# EAGLE design CZT_Board_v1_4 (EAGLE 4.15)
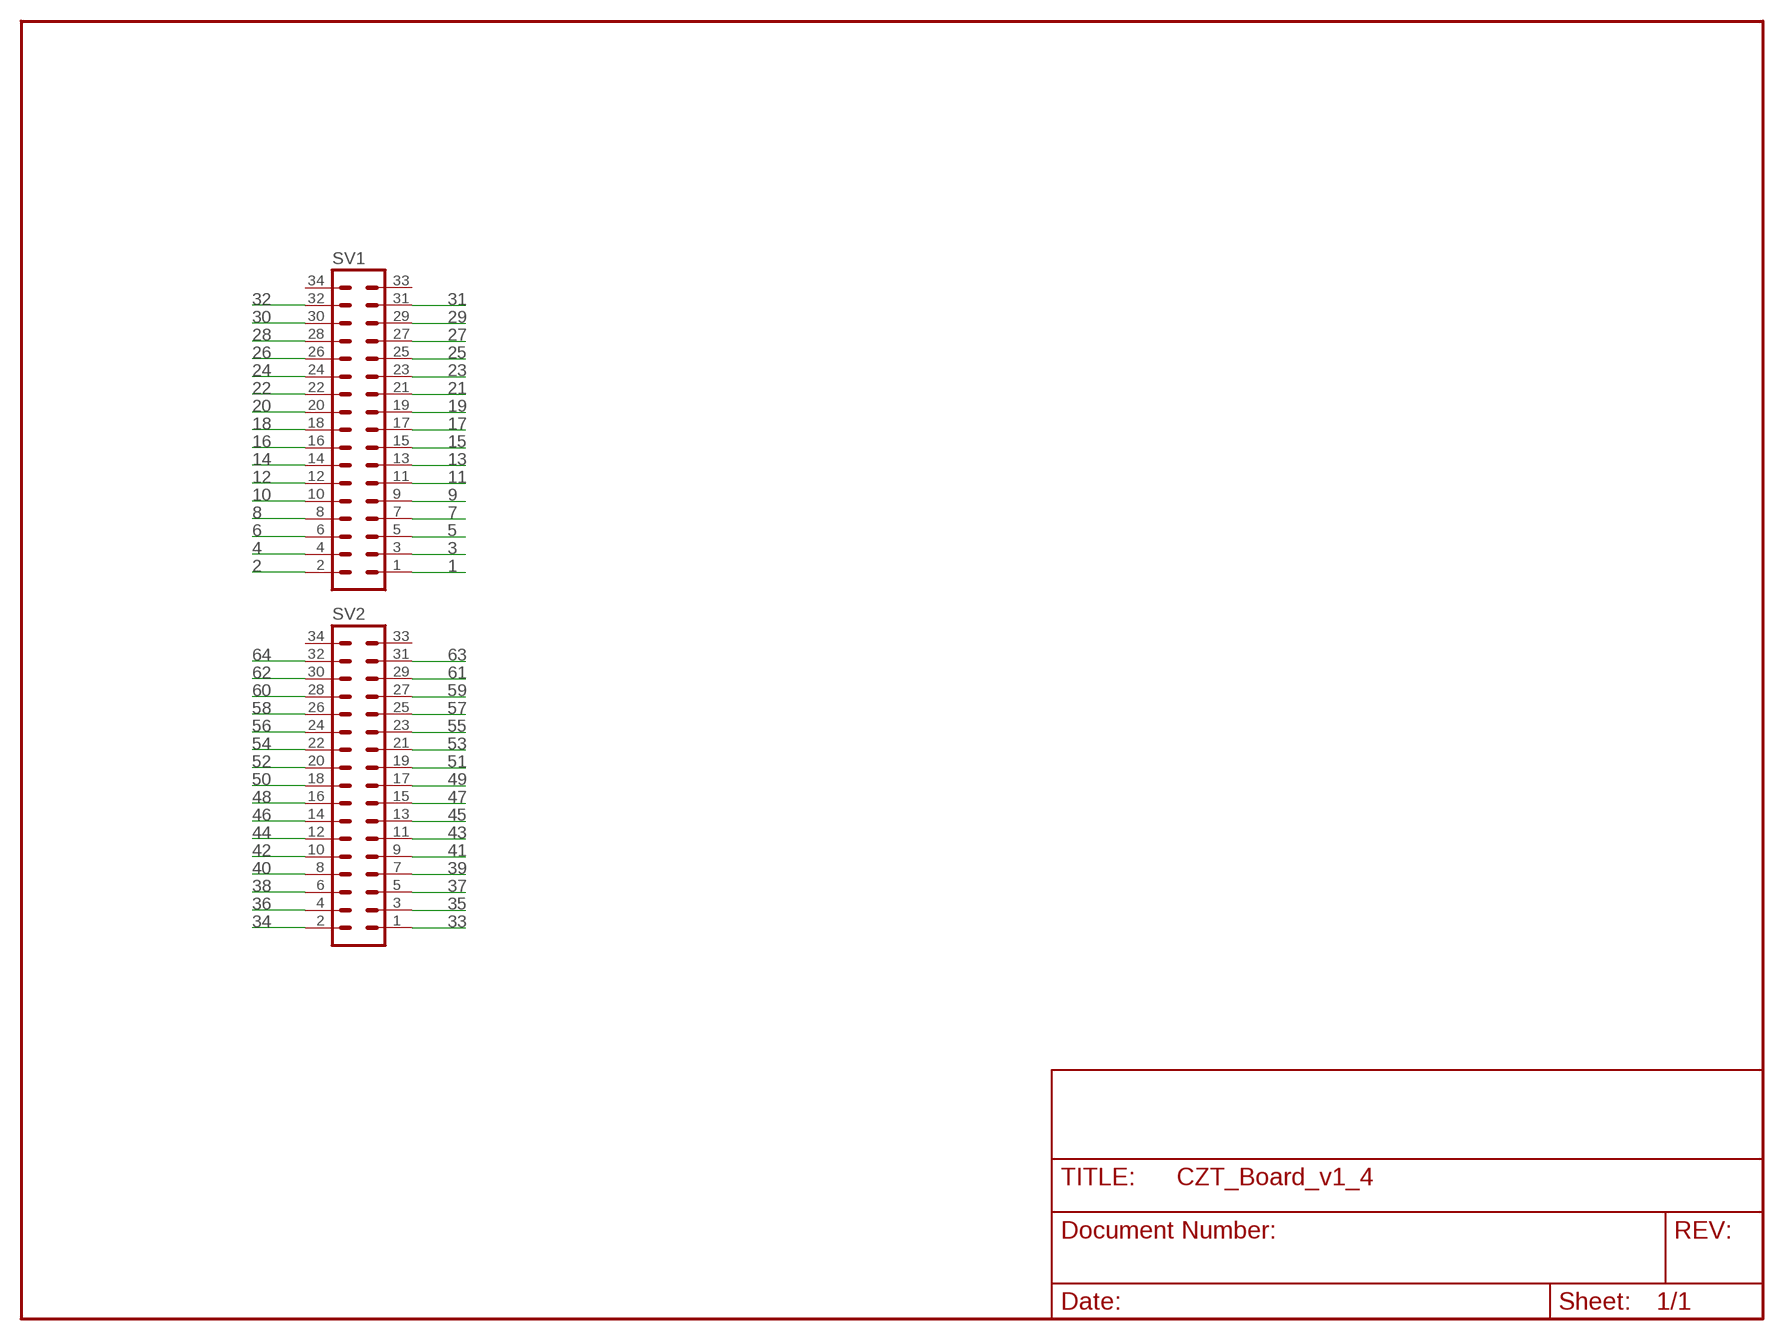
[diagram p0: schematic, sheet 1]

## Parts
SV1  MA17-2  [MA17-2]
SV2  MA17-2  [MA17-2]

## Nets
1: SV1.1
2: SV1.2
3: SV1.3
4: SV1.4
5: SV1.5
6: SV1.6
7: SV1.7
8: SV1.8
9: SV1.9
10: SV1.10
11: SV1.11
12: SV1.12
13: SV1.13
14: SV1.14
15: SV1.15
16: SV1.16
17: SV1.17
18: SV1.18
19: SV1.19
20: SV1.20
21: SV1.21
22: SV1.22
23: SV1.23
24: SV1.24
25: SV1.25
26: SV1.26
27: SV1.27
28: SV1.28
29: SV1.29
30: SV1.30
31: SV1.31
32: SV1.32
33: SV2.1
34: SV2.2
35: SV2.3
36: SV2.4
37: SV2.5
38: SV2.6
39: SV2.7
40: SV2.8
41: SV2.9
42: SV2.10
43: SV2.11
44: SV2.12
45: SV2.13
46: SV2.14
47: SV2.15
48: SV2.16
49: SV2.17
50: SV2.18
51: SV2.19
52: SV2.20
53: SV2.21
54: SV2.22
55: SV2.23
56: SV2.24
57: SV2.25
58: SV2.26
59: SV2.27
60: SV2.28
61: SV2.29
62: SV2.30
63: SV2.31
64: SV2.32
Unconnected: SV1.33 SV1.34 SV2.33 SV2.34

## Library data of the parts
SV1 SV2 = con-lstb:MA17-2: PIN HEADER

## Board
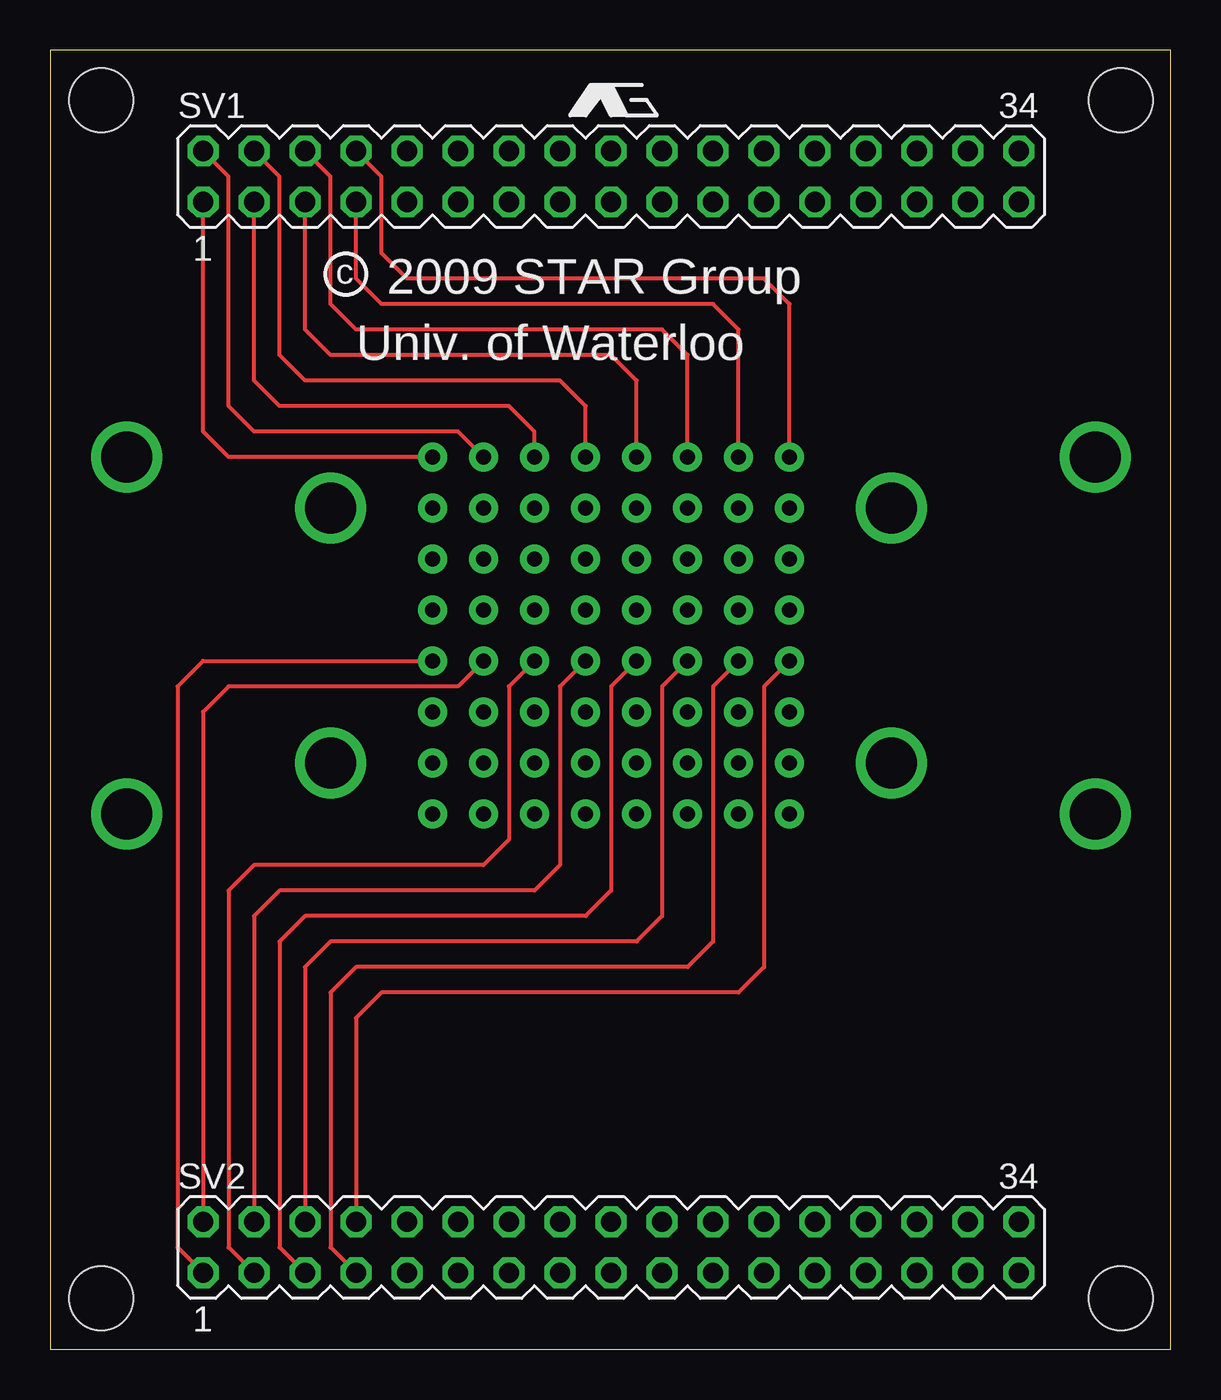
[diagram p1: board, top side]
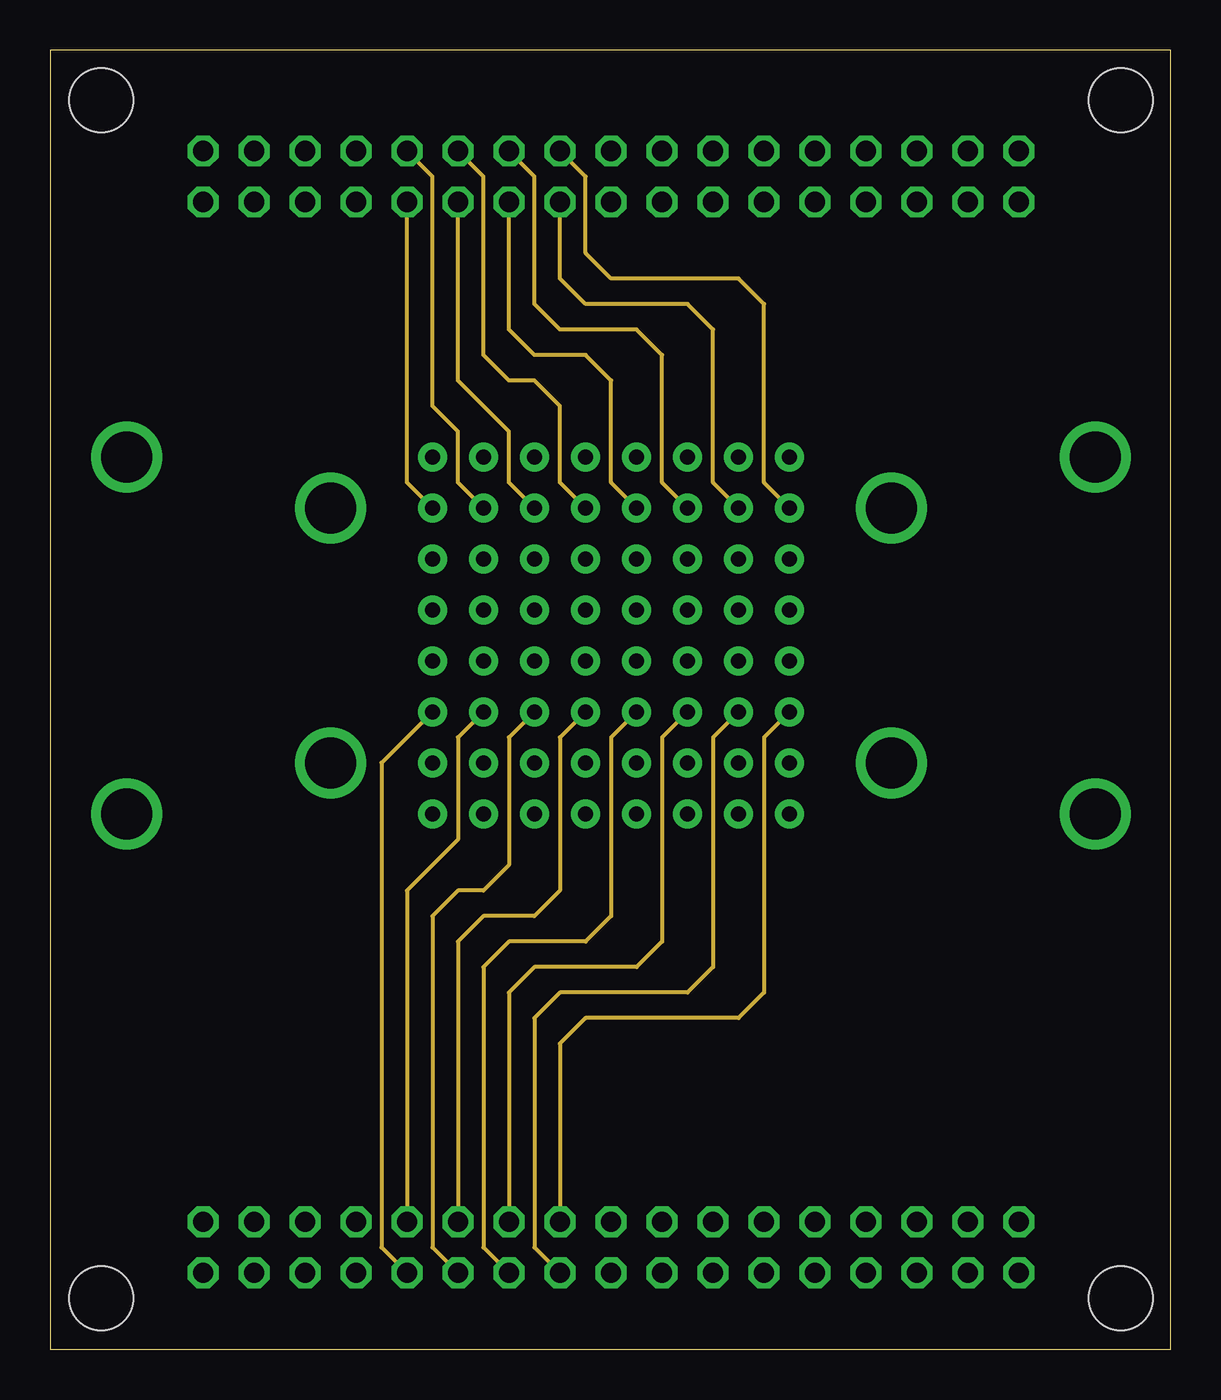
[diagram p2: board, inner layer Route2]
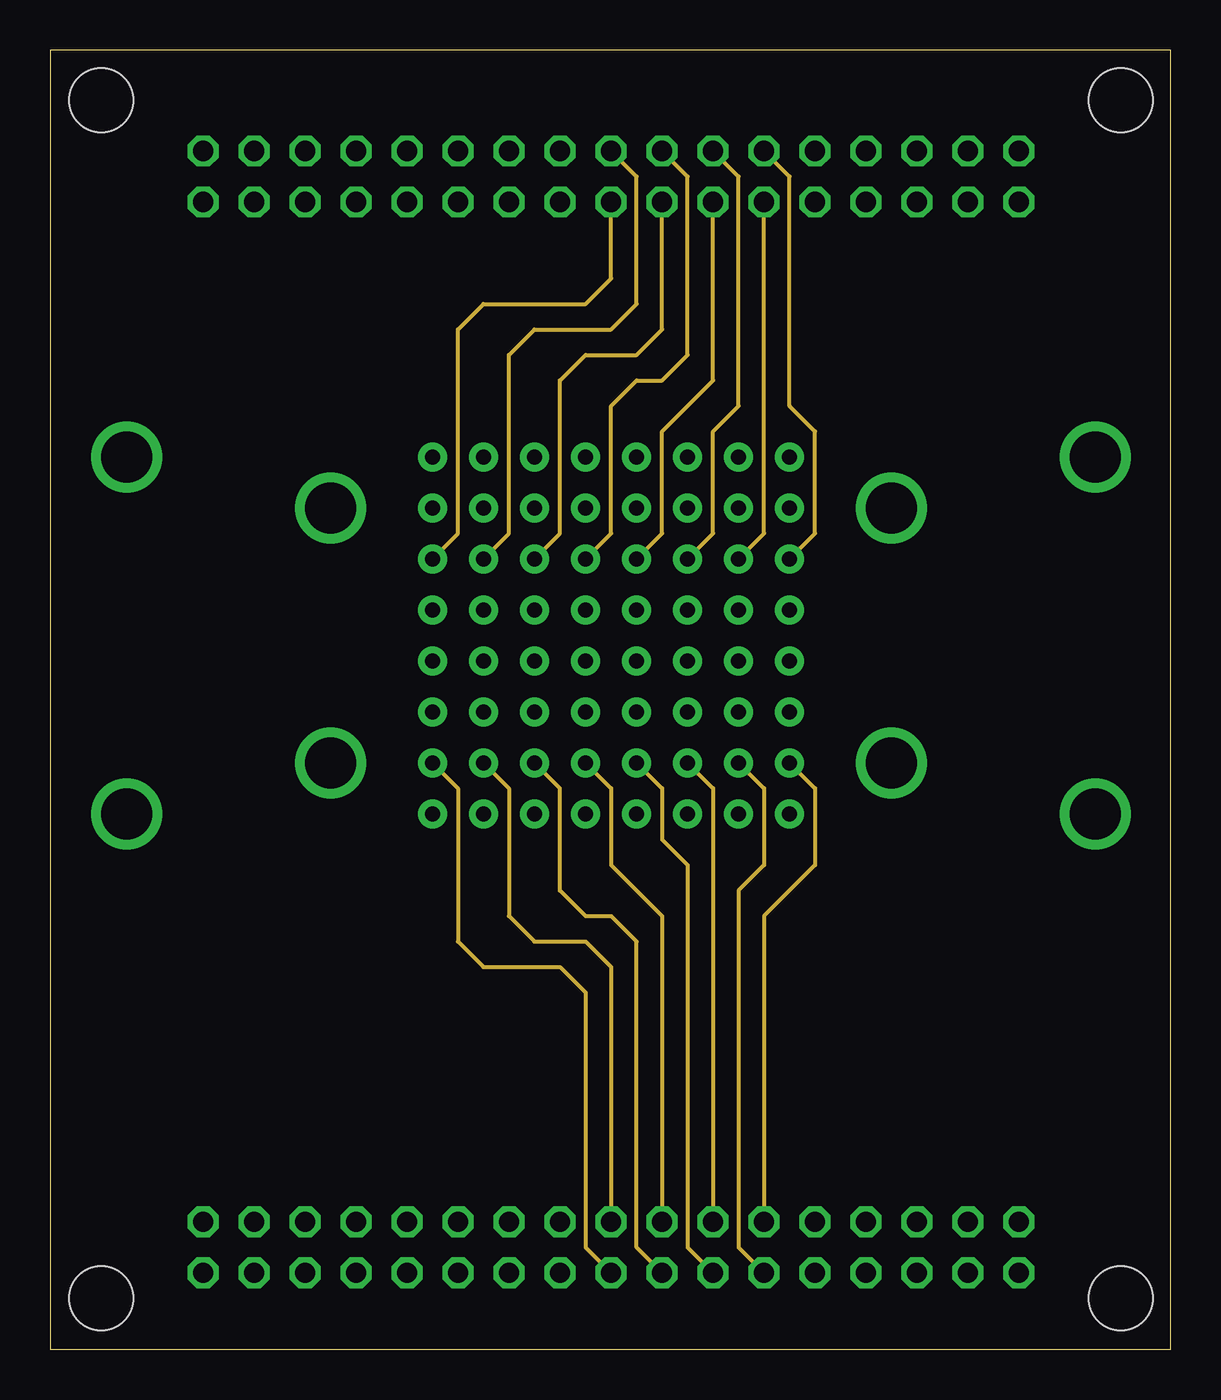
[diagram p3: board, inner layer Route15]
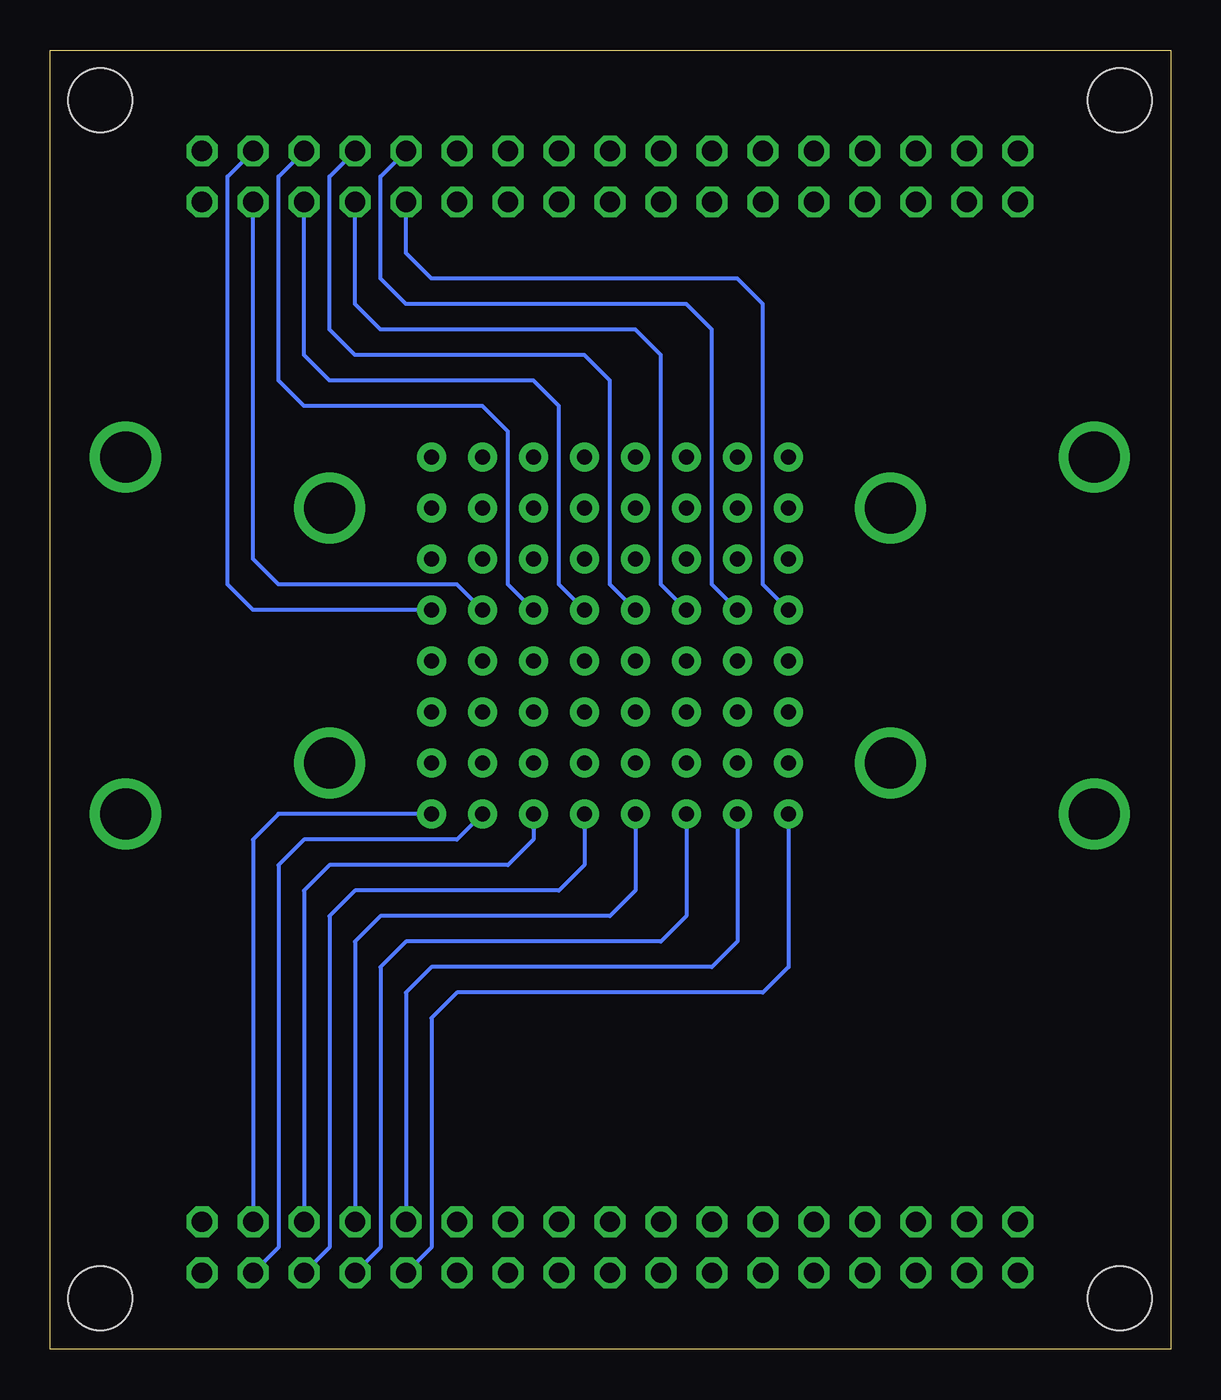
[diagram p4: board, bottom side, seen from below]

Size 55.83 x 64.72 mm. Coordinates in mm from the lower left corner, seen from the top.
Outline: 0,0 55.83,0 55.83,64.72 0,64.72 0,0
Copper layers (1*2*15*16): Top 0.035mm / dielectric 1.5mm / Route2 0.035mm / dielectric 0.15mm / Route15 0.035mm / dielectric 0.2mm / Bottom 0.035mm
Design rules "default": minimum track width 8mil, minimum drill 20mil, track to track 7mil, track to pad 7mil, pad to pad 7mil, via to via 7mil, smd to smd 7mil, copper to edge 20mil, drill to drill 8mil, minimum pad ring 10mil, minimum via ring 8mil, stop-mask expansion 4mil, vias tented up to drill 0mil, thermal gap 10mil
Holes 3.17 mm at 53.34,62.23 2.54,62.23 2.54,2.54 53.34,2.54

### Footprints (pad centres in the part's own frame; a part is rotated, then mirrored left to right if it is on the bottom)
MA17-2 = drill 1.016 octagon: 1 -20.32,-1.27; 2 -20.32,1.27; 3 -17.78,-1.27; 4 -17.78,1.27; 5 -15.24,-1.27; 6 -15.24,1.27; 7 -12.7,-1.27; 8 -12.7,1.27; 9 -10.16,-1.27; 10 -10.16,1.27; 11 -7.62,-1.27; 12 -7.62,1.27; 13 -5.08,-1.27; 14 -5.08,1.27; 15 -2.54,-1.27; 16 -2.54,1.27; 17 0,-1.27; 18 0,1.27; 19 2.54,-1.27; 20 2.54,1.27; 21 5.08,-1.27; 22 5.08,1.27; 23 7.62,-1.27; 24 7.62,1.27; 25 10.16,-1.27; 26 10.16,1.27; 27 12.7,-1.27; 28 12.7,1.27; 29 15.24,-1.27; 30 15.24,1.27; 31 17.78,-1.27; 32 17.78,1.27; 33 20.32,-1.27; 34 20.32,1.27

### Placement (x,y rotation side)
SV1  27.94,58.42 0 top
SV2  27.94,5.08 0 top

### Tracks (layer width: path | path; a pad name or v marks a point on that pad's centre or on a via)
1  (via drill 0.76 pad 1.42)
  Top 0.203: v19.05,44.45 8.89,44.45 7.62,45.72 SV1.1
2  (via drill 0.76 pad 1.42)
  Top 0.203: v21.59,44.45 20.32,45.72 10.16,45.72 8.89,46.99 8.89,58.42 SV1.2
3  (via drill 0.76 pad 1.42)
  Top 0.203: v24.13,44.45 24.13,45.72 22.86,46.99 11.43,46.99 10.16,48.26 SV1.3
4  (via drill 0.76 pad 1.42)
  Top 0.203: v26.67,44.45 26.67,46.99 25.4,48.26 12.7,48.26 11.43,49.53 11.43,58.42 SV1.4
5  (via drill 0.76 pad 1.42)
  Top 0.203: v29.21,44.45 29.21,48.26 27.94,49.53 13.97,49.53 12.7,50.8 SV1.5
6  (via drill 0.76 pad 1.42)
  Top 0.203: v31.75,44.45 31.75,49.53 30.48,50.8 15.24,50.8 13.97,52.07 13.97,58.42 SV1.6
7  (via drill 0.76 pad 1.42)
  Top 0.203: v34.29,44.45 34.29,50.8 33.02,52.07 16.51,52.07 15.24,53.34 SV1.7
8  (via drill 0.76 pad 1.42)
  Top 0.203: v36.83,44.45 36.83,52.07 35.56,53.34 17.78,53.34 16.51,54.61 16.51,58.42 SV1.8
9  (via drill 0.76 pad 1.42)
  Route2 0.203: v19.05,41.91 17.78,43.18 SV1.9
10  (via drill 0.76 pad 1.42)
  Route2 0.203: v21.59,41.91 20.32,43.18 20.32,45.72 19.05,46.99 19.05,58.42 SV1.10
11  (via drill 0.76 pad 1.42)
  Route2 0.203: v24.13,41.91 22.86,43.18 22.86,45.72 20.32,48.26 SV1.11
12  (via drill 0.76 pad 1.42)
  Route2 0.203: v26.67,41.91 25.4,43.18 25.4,46.99 24.13,48.26 22.86,48.26 21.59,49.53 21.59,58.42 SV1.12
13  (via drill 0.76 pad 1.42)
  Route2 0.203: v29.21,41.91 27.94,43.18 27.94,48.26 26.67,49.53 24.13,49.53 22.86,50.8 SV1.13
14  (via drill 0.76 pad 1.42)
  Route2 0.203: v31.75,41.91 30.48,43.18 30.48,49.53 29.21,50.8 25.4,50.8 24.13,52.07 24.13,58.42 SV1.14
15  (via drill 0.76 pad 1.42)
  Route2 0.203: v34.29,41.91 33.02,43.18 33.02,50.8 31.75,52.07 26.67,52.07 25.4,53.34 SV1.15
16  (via drill 0.76 pad 1.42)
  Route2 0.203: v36.83,41.91 35.56,43.18 35.56,52.07 34.29,53.34 27.94,53.34 26.67,54.61 26.67,58.42 SV1.16
17  (via drill 0.76 pad 1.42)
  Route15 0.203: v19.05,39.37 20.32,40.64 20.32,50.8 21.59,52.07 26.67,52.07 27.94,53.34 SV1.17
18  (via drill 0.76 pad 1.42)
  Route15 0.203: v21.59,39.37 22.86,40.64 22.86,49.53 24.13,50.8 27.94,50.8 29.21,52.07 29.21,58.42 SV1.18
19  (via drill 0.76 pad 1.42)
  Route15 0.203: v24.13,39.37 25.4,40.64 25.4,48.26 26.67,49.53 29.21,49.53 30.48,50.8 SV1.19
20  (via drill 0.76 pad 1.42)
  Route15 0.203: v26.67,39.37 27.94,40.64 27.94,46.99 29.21,48.26 30.48,48.26 31.75,49.53 31.75,58.42 SV1.20
21  (via drill 0.76 pad 1.42)
  Route15 0.203: v29.21,39.37 30.48,40.64 30.48,45.72 33.02,48.26 SV1.21
22  (via drill 0.76 pad 1.42)
  Route15 0.203: v31.75,39.37 33.02,40.64 33.02,45.72 34.29,46.99 34.29,58.42 SV1.22
23  (via drill 0.76 pad 1.42)
  Route15 0.203: v34.29,39.37 35.56,40.64 SV1.23
24  (via drill 0.76 pad 1.42)
  Route15 0.203: v36.83,39.37 38.1,40.64 38.1,45.72 36.83,46.99 36.83,58.42 SV1.24
25  (via drill 0.76 pad 1.42)
  Bottom 0.203: v19.05,36.83 20.32,38.1 20.32,52.07 21.59,53.34 36.83,53.34 38.1,54.61 SV1.25
26  (via drill 0.76 pad 1.42)
  Bottom 0.203: v21.59,36.83 22.86,38.1 22.86,50.8 24.13,52.07 38.1,52.07 39.37,53.34 39.37,58.42 SV1.26
27  (via drill 0.76 pad 1.42)
  Bottom 0.203: v24.13,36.83 25.4,38.1 25.4,49.53 26.67,50.8 39.37,50.8 40.64,52.07 SV1.27
28  (via drill 0.76 pad 1.42)
  Bottom 0.203: v26.67,36.83 27.94,38.1 27.94,48.26 29.21,49.53 40.64,49.53 41.91,50.8 41.91,58.42 SV1.28
29  (via drill 0.76 pad 1.42)
  Bottom 0.203: v29.21,36.83 30.48,38.1 30.48,46.99 31.75,48.26 41.91,48.26 43.18,49.53 SV1.29
30  (via drill 0.76 pad 1.42)
  Bottom 0.203: v31.75,36.83 33.02,38.1 33.02,45.72 34.29,46.99 43.18,46.99 44.45,48.26 44.45,58.42 SV1.30
31  (via drill 0.76 pad 1.42)
  Bottom 0.203: v34.29,36.83 35.56,38.1 44.45,38.1 45.72,39.37 SV1.31
32  (via drill 0.76 pad 1.42)
  Bottom 0.203: v36.83,36.83 45.72,36.83 46.99,38.1 46.99,58.42 SV1.32
33  (via drill 0.76 pad 1.42)
  Top 0.203: v19.05,34.29 7.62,34.29 6.35,33.02 6.35,5.08 SV2.1
34  (via drill 0.76 pad 1.42)
  Top 0.203: v21.59,34.29 20.32,33.02 8.89,33.02 7.62,31.75 SV2.2
35  (via drill 0.76 pad 1.42)
  Top 0.203: v24.13,34.29 22.86,33.02 22.86,25.4 21.59,24.13 10.16,24.13 8.89,22.86 8.89,5.08 SV2.3
36  (via drill 0.76 pad 1.42)
  Top 0.203: v26.67,34.29 25.4,33.02 25.4,24.13 24.13,22.86 11.43,22.86 10.16,21.59 SV2.4
37  (via drill 0.76 pad 1.42)
  Top 0.203: v29.21,34.29 27.94,33.02 27.94,22.86 26.67,21.59 12.7,21.59 11.43,20.32 11.43,5.08 SV2.5
38  (via drill 0.76 pad 1.42)
  Top 0.203: v31.75,34.29 30.48,33.02 30.48,21.59 29.21,20.32 13.97,20.32 12.7,19.05 SV2.6
39  (via drill 0.76 pad 1.42)
  Top 0.203: v34.29,34.29 33.02,33.02 33.02,20.32 31.75,19.05 15.24,19.05 13.97,17.78 13.97,5.08 SV2.7
40  (via drill 0.76 pad 1.42)
  Top 0.203: v36.83,34.29 35.56,33.02 35.56,19.05 34.29,17.78 16.51,17.78 15.24,16.51 SV2.8
41  (via drill 0.76 pad 1.42)
  Route2 0.203: v19.05,31.75 16.51,29.21 16.51,5.08 SV2.9
42  (via drill 0.76 pad 1.42)
  Route2 0.203: v21.59,31.75 20.32,30.48 20.32,25.4 17.78,22.86 SV2.10
43  (via drill 0.76 pad 1.42)
  Route2 0.203: v24.13,31.75 22.86,30.48 22.86,24.13 21.59,22.86 20.32,22.86 19.05,21.59 19.05,5.08 SV2.11
44  (via drill 0.76 pad 1.42)
  Route2 0.203: v26.67,31.75 25.4,30.48 25.4,22.86 24.13,21.59 21.59,21.59 20.32,20.32 SV2.12
45  (via drill 0.76 pad 1.42)
  Route2 0.203: v29.21,31.75 27.94,30.48 27.94,21.59 26.67,20.32 22.86,20.32 21.59,19.05 21.59,5.08 SV2.13
46  (via drill 0.76 pad 1.42)
  Route2 0.203: v31.75,31.75 30.48,30.48 30.48,20.32 29.21,19.05 24.13,19.05 22.86,17.78 SV2.14
47  (via drill 0.76 pad 1.42)
  Route2 0.203: v34.29,31.75 33.02,30.48 33.02,19.05 31.75,17.78 25.4,17.78 24.13,16.51 24.13,5.08 SV2.15
48  (via drill 0.76 pad 1.42)
  Route2 0.203: v36.83,31.75 35.56,30.48 35.56,17.78 34.29,16.51 26.67,16.51 25.4,15.24 SV2.16
49  (via drill 0.76 pad 1.42)
  Route15 0.203: v19.05,29.21 20.32,27.94 20.32,20.32 21.59,19.05 25.4,19.05 26.67,17.78 26.67,5.08 SV2.17
50  (via drill 0.76 pad 1.42)
  Route15 0.203: v21.59,29.21 22.86,27.94 22.86,21.59 24.13,20.32 26.67,20.32 27.94,19.05 SV2.18
51  (via drill 0.76 pad 1.42)
  Route15 0.203: v24.13,29.21 25.4,27.94 25.4,22.86 26.67,21.59 27.94,21.59 29.21,20.32 29.21,5.08 SV2.19
52  (via drill 0.76 pad 1.42)
  Route15 0.203: v26.67,29.21 27.94,27.94 27.94,24.13 30.48,21.59 SV2.20
53  (via drill 0.76 pad 1.42)
  Route15 0.203: v29.21,29.21 30.48,27.94 30.48,25.4 31.75,24.13 31.75,5.08 SV2.21
54  (via drill 0.76 pad 1.42)
  Route15 0.203: v31.75,29.21 33.02,27.94 SV2.22
55  (via drill 0.76 pad 1.42)
  Route15 0.203: v34.29,29.21 35.56,27.94 35.56,24.13 34.29,22.86 34.29,5.08 SV2.23
56  (via drill 0.76 pad 1.42)
  Route15 0.203: v36.83,29.21 38.1,27.94 38.1,24.13 35.56,21.59 SV2.24
57  (via drill 0.76 pad 1.42)
  Bottom 0.203: v19.05,26.67 19.05,19.05 20.32,17.78 35.56,17.78 36.83,16.51 36.83,5.08 SV2.25
58  (via drill 0.76 pad 1.42)
  Bottom 0.203: v21.59,26.67 21.59,20.32 22.86,19.05 36.83,19.05 38.1,17.78 SV2.26
59  (via drill 0.76 pad 1.42)
  Bottom 0.203: v24.13,26.67 24.13,21.59 25.4,20.32 38.1,20.32 39.37,19.05 39.37,5.08 SV2.27
60  (via drill 0.76 pad 1.42)
  Bottom 0.203: v26.67,26.67 26.67,22.86 27.94,21.59 39.37,21.59 40.64,20.32 SV2.28
61  (via drill 0.76 pad 1.42)
  Bottom 0.203: v29.21,26.67 29.21,24.13 30.48,22.86 40.64,22.86 41.91,21.59 41.91,5.08 SV2.29
62  (via drill 0.76 pad 1.42)
  Bottom 0.203: v31.75,26.67 31.75,25.4 33.02,24.13 41.91,24.13 43.18,22.86 SV2.30
63  (via drill 0.76 pad 1.42)
  Bottom 0.203: v34.29,26.67 35.56,25.4 43.18,25.4 44.45,24.13 44.45,5.08 SV2.31
64  (via drill 0.76 pad 1.42)
  Bottom 0.203: v36.83,26.67 44.45,26.67 45.72,25.4 SV2.32
N$1  (via drill 2.54)
  other vias: 13.97,41.91
N$2  (via drill 2.54)
  other vias: 41.91,41.91
N$3  (via drill 2.54)
  other vias: 41.91,29.21
N$4  (via drill 2.54)
  other vias: 13.97,29.21
N$5  (via drill 2.54)
  other vias: 52.07,44.45
N$6  (via drill 2.54)
  other vias: 52.07,26.67
N$7  (via drill 2.54)
  other vias: 3.81,44.45
N$8  (via drill 2.54)
  other vias: 3.81,26.67

### Text on the board
tPlace: c | 2009 STAR Group | Univ. of Waterloo